# Altium schematic sheet VertBallCounter.SchDoc: Vertical Ball Counter
size A4; SheetNumber: 5
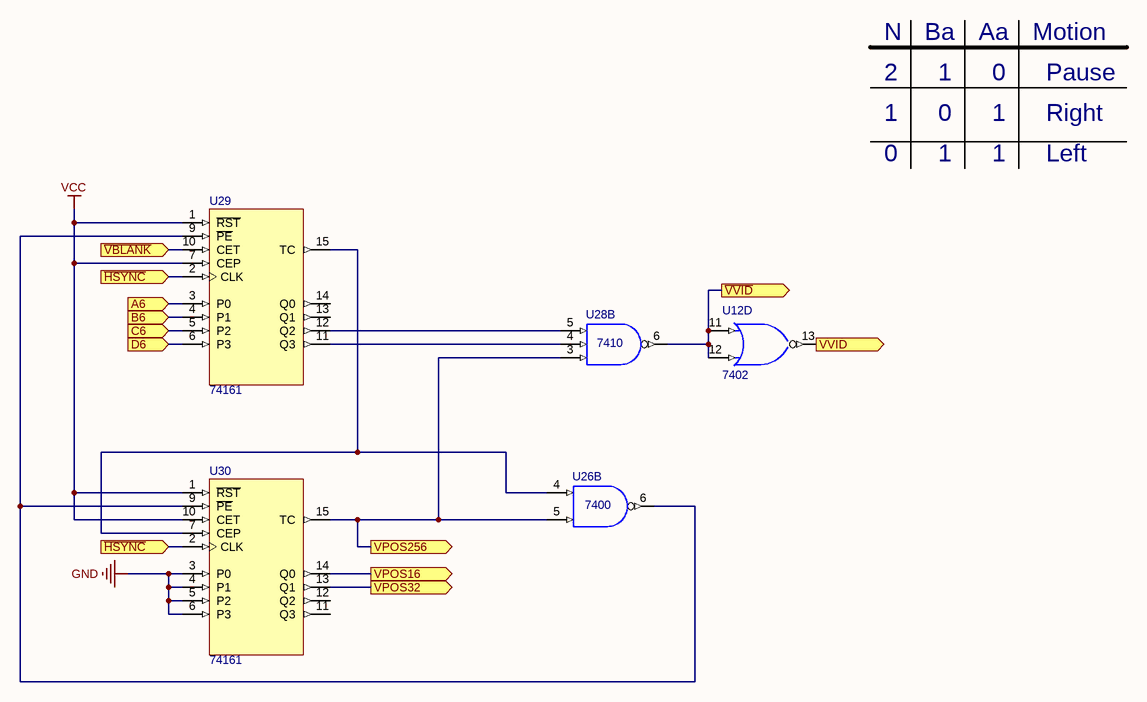
[diagram p0: VertBallCounter.SchDoc]

## Parts
U12  7402  [N014]  (part D of 4)
U26  7400  [N014]  (part B of 4)
U28  7410  [N014]  (part B of 3)
U29  74161  [N016]
U30  74161  [N016]

## Ports
A6, B6, C6, D6, VPOS16, VPOS32, VPOS256, VVID, ~{HSYNC}, ~{VBLANK}, ~{VVID}

## Nets
GND: U12.7(GND) U26.7(GND) U28.7(GND) U29.8(GND) U30.3(P0) U30.4(P1) U30.5(P2) U30.6(P3) U30.8(GND)
VCC: U12.14(VCC) U26.14(VCC) U28.14(VCC) U29.1(~{RST}) U29.7(CEP) U29.16(VCC) U30.1(~{RST}) U30.10(CET) U30.16(VCC)
~{HSYNC}: U29.2(CLK) U30.2(CLK) ; port ~{HSYNC}
~{VBLANK}: U29.10(CET) ; port ~{VBLANK}
~{VVID}: U12.11(A) U12.12(B) U28.6(Y) ; port ~{VVID}
A6: U29.3(P0) ; port A6
B6: U29.4(P1) ; port B6
C6: U29.5(P2) ; port C6
D6: U29.6(P3) ; port D6
VPOS16: U30.14(Q0) ; port VPOS16
VPOS32: U30.13(Q1) ; port VPOS32
VPOS256: U26.5(B) U28.3(A) U30.15(TC) ; port VPOS256
VVID: U12.13(Y) ; port VVID
NetU26_4: U26.4(A) U29.15(TC) U30.7(CEP)
NetU26_6: U26.6(Y) U29.9(~{PE}) U30.9(~{PE})
NetU28_4: U28.4(B) U29.11(Q3)
NetU28_5: U28.5(C) U29.12(Q2)

Not connected (* = marked no-connect by the designer): U29 13(Q1) 14(Q0); U30 11(Q3) 12(Q2)

## Notes on the sheet
- N
- 2
- Ba
- 1
- Aa
- 0
- Motion
- Pause
- Right
- Left
- Text
- Page
- PONG

## Library data of the parts
U12 = SN74LS02N: Quadruple 2-Input Positive-NOR Gate; Published: 8-Jun-2000; LatestRevisionDate: 04-Mar-2005; LatestRevisionNote: Stylized 3D Model Added.; DatasheetVersion: Mar-1988; PackageVersion: Oct-1995; PackageReference: N014; Publisher: Altium Limited; PackageDescription: DIP; 14 Leads; Row Spacing 7.62 mm; Pitch 2.54 mm; ComponentLink1Description: Manufacturer Link; ComponentLink1URL: http://www.ti.com/; ComponentLink2Description: Datasheet; ComponentLink2URL: http://www-s.ti.com/sc/ds/sn54s02.pdf
U26 = SN74LS00N: Quadruple 2-Input Positive-NAND Gate; Published: 8-Jun-2000; LatestRevisionDate: 04-Mar-2005; LatestRevisionNote: Stylized 3D Model Added.; DatasheetVersion: Mar-1988; PackageVersion: Oct-1995; PackageReference: N014; Publisher: Altium Limited; PackageDescription: DIP; 14 Leads; Row Spacing 7.62 mm; Pitch 2.54 mm; ComponentLink1Description: Manufacturer Link; ComponentLink1URL: http://www.ti.com/; ComponentLink2Description: Datasheet; ComponentLink2URL: http://www-s.ti.com/sc/ds/sn74ls00.pdf
U28 = SN74LS10N: Triple 3-Input Positive-NAND Gate; Published: 8-Jun-2000; LatestRevisionDate: 04-Mar-2005; LatestRevisionNote: Stylized 3D Model Added.; DatasheetVersion: Mar-1988; PackageVersion: Oct-1995; PackageReference: N014; Publisher: Altium Limited; PackageDescription: DIP; 14 Leads; Row Spacing 7.62 mm; Pitch 2.54 mm; ComponentLink1Description: Manufacturer Link; ComponentLink1URL: http://www.ti.com/; ComponentLink2Description: Datasheet; ComponentLink2URL: http://www-s.ti.com/sc/ds/sn74ls10.pdf
U29 U30 = SN74LS161AN: Synchronous 4-Bit Counter; Published: 8-Jun-2000; LatestRevisionDate: 04-Mar-2005; LatestRevisionNote: Stylized 3D Model Added.; DatasheetVersion: Mar-1988; PackageVersion: Oct-1995; PackageReference: N016; Publisher: Altium Limited; PackageDescription: DIP; 16 Leads; Row Spacing 7.62 mm; Pitch 2.54 mm; Code_JEDEC: MS-001-BB; ComponentLink1Description: Manufacturer Link; ComponentLink1URL: http://www.ti.com/; ComponentLink2Description: Datasheet; ComponentLink2URL: http://www-s.ti.com/sc/ds/sn74ls161a.pdf; ComponentLink3Description: URL Link1; ComponentLink3URL: http://focus.ti.com/docs/prod/folders/print/sn74ls161a.html